# Altium schematic sheet PCB_Master_Traffic_Light_COVER_PAGE.SchDoc
size A3; SheetNumber: 1; SheetTotal: 3
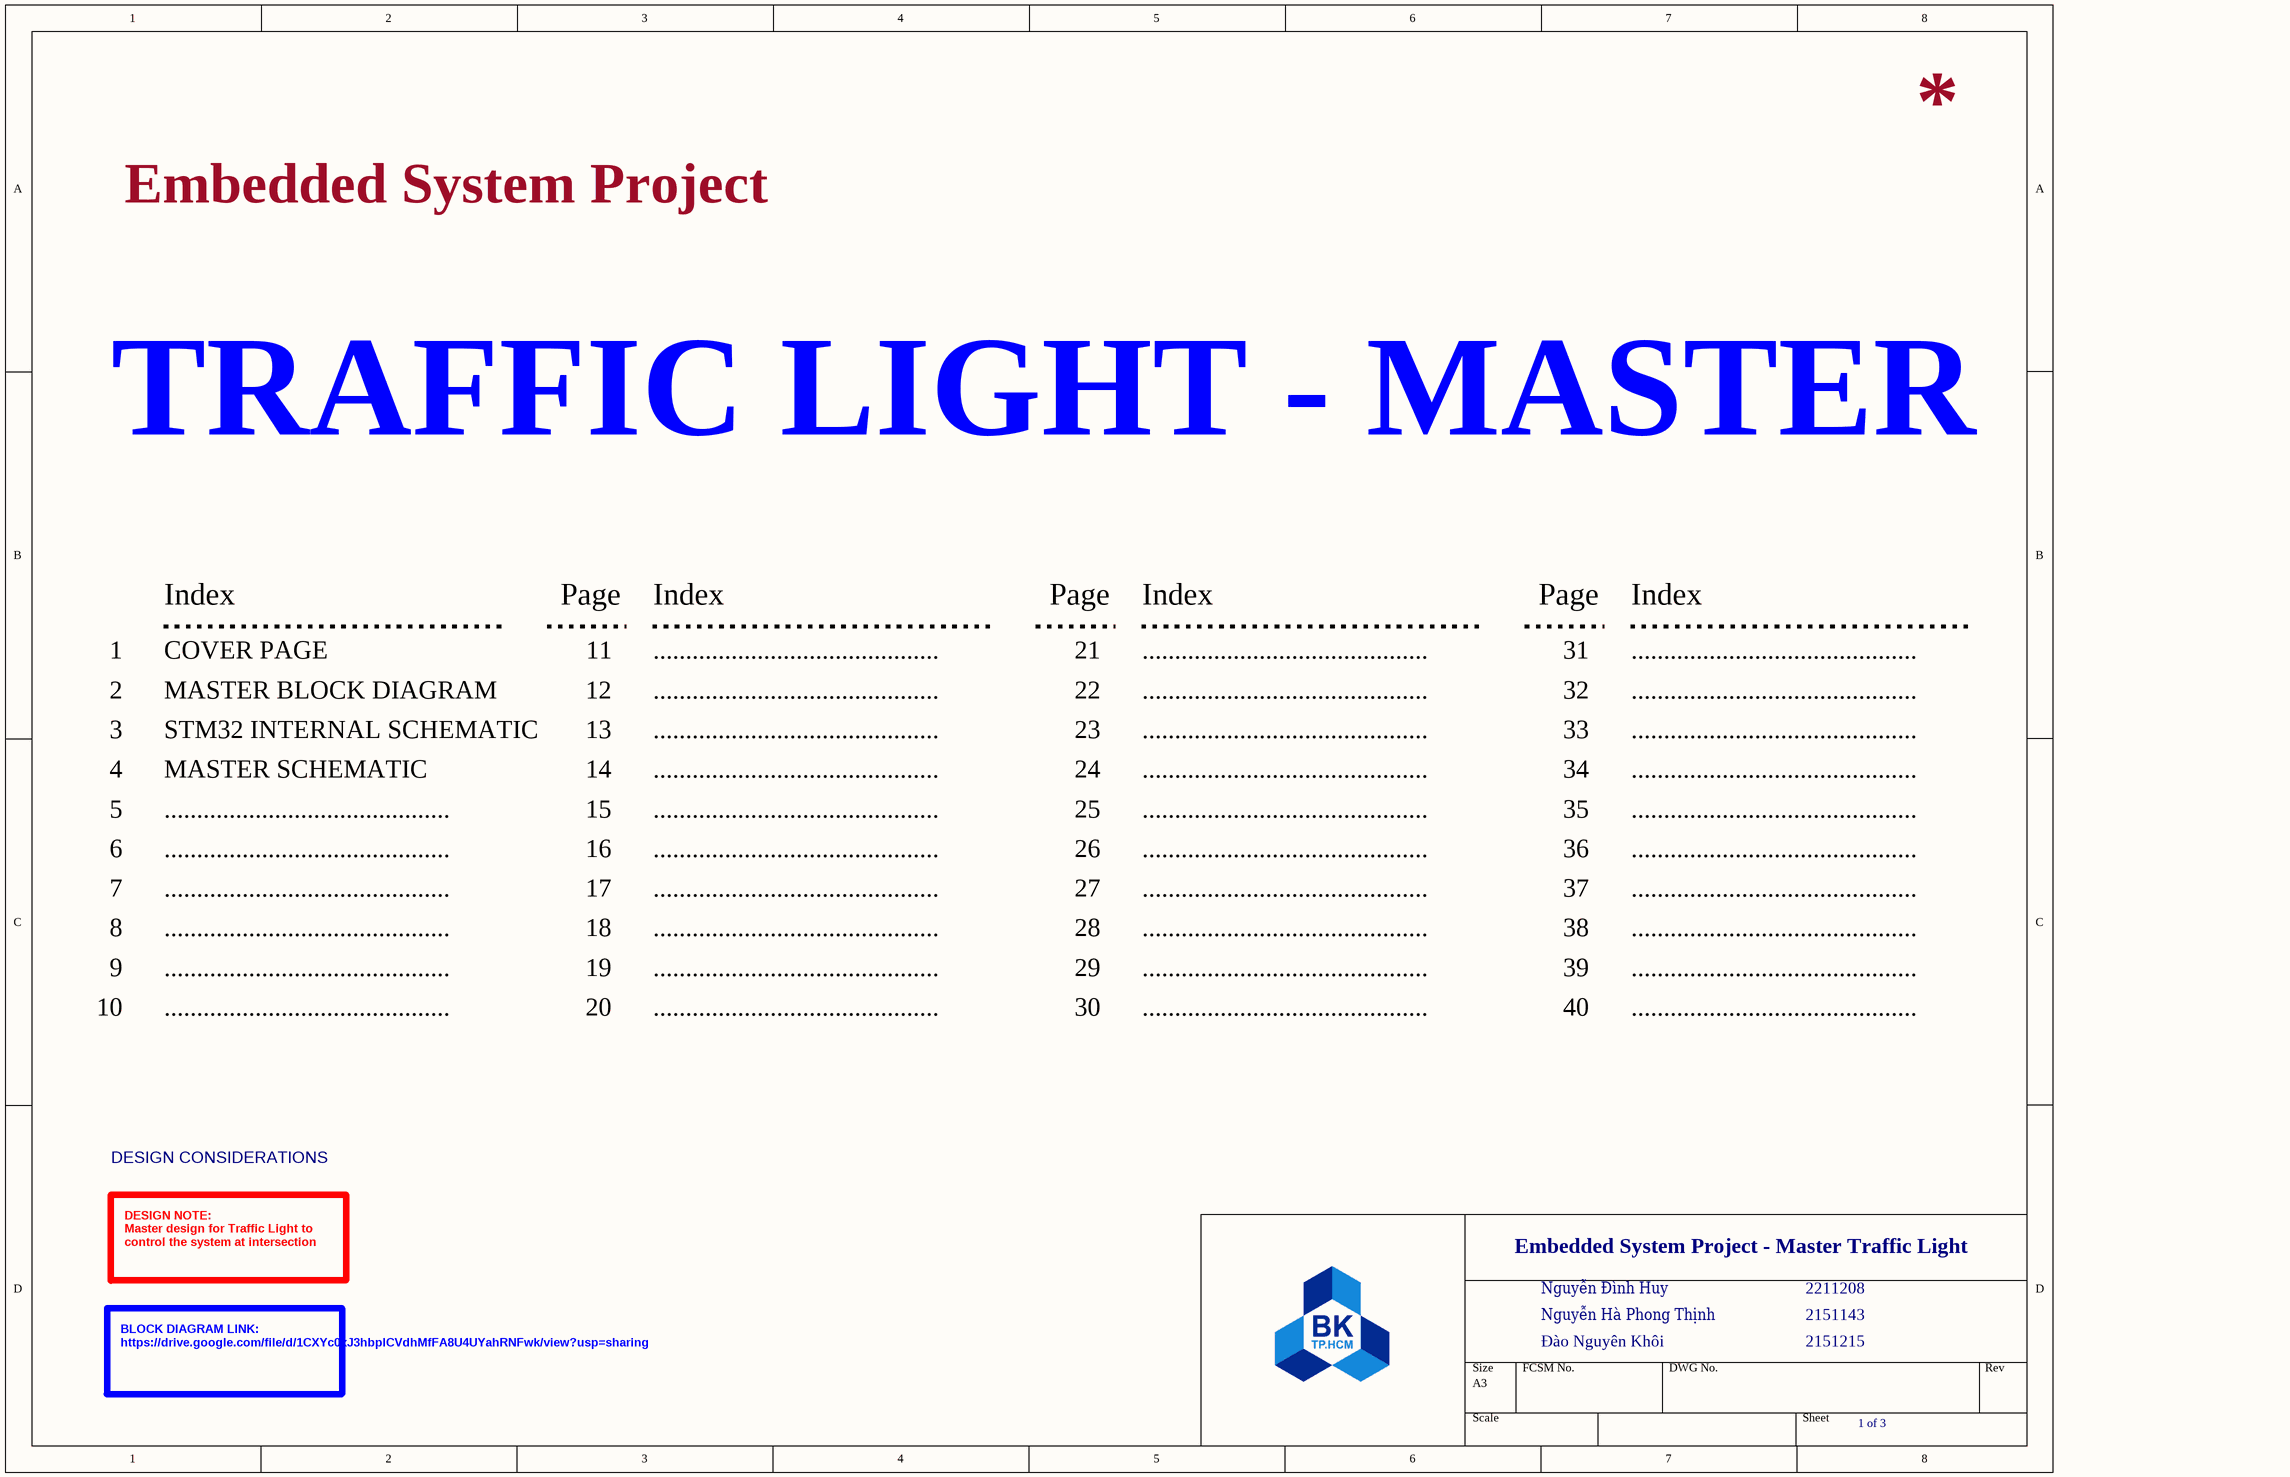
[diagram p0: PCB_Master_Traffic_Light_COVER_PAGE.SchDoc]

## Notes on the sheet
- Embedded System Project
- TRAFFIC LIGHT - MASTER
- Index
- Page
- 1
- 2
- COVER PAGE
- MASTER BLOCK DIAGRAM
- 11
- 12
- ............................................
- 21
- 22
- 31
- 32
- 3
- STM32 INTERNAL SCHEMATIC
- 13
- 23
- 33
- 4
- 5
- MASTER SCHEMATIC
- 14
- 15
- 24
- 25
- 34
- 35
- 6
- 7
- 16
- 17
- 26
- 27
- 36
- 37
- 8
- 18
- 28
- 38
- 9
- 10
- 19
- 20
- 29
- 30
- 39
- 40
- DESIGN CONSIDERATIONS
- DESIGN NOTE:
  Master design for Traffic Light to control the system at intersection
- Embedded System Project - Master Traffic Light
- Nguyễn Đình Huy
- 2211208
- Nguyễn Hà Phong Thịnh
- Đào Nguyên Khôi
- 2151143
- 2151215
- BLOCK DIAGRAM LINK:
  https://drive.google.com/file/d/1CXYc0xJ3hbplCVdhMfFA8U4UYahRNFwk/view?usp=sharing
- 1 of 3